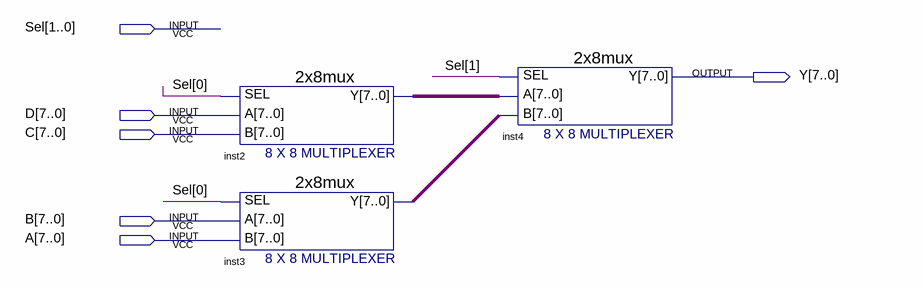
[diagram p0: schematic sheet]
// Quartus schematic mux4x8.bdf as structural Verilog: 3 symbols, 6 pins
module mux4x8 (
  input  [1:0] Sel,
  input  [7:0] D,
  input  [7:0] C,
  input  [7:0] B,
  input  [7:0] A,
  output [7:0] Y
);

  wire [7:0] inst2_y, inst3_y;

  \2x8mux  inst2 (.SEL(Sel[0]), .A(D), .B(C), .Y(inst2_y));
  \2x8mux  inst3 (.SEL(Sel[0]), .A(B), .B(A), .Y(inst3_y));
  \2x8mux  inst4 (.SEL(Sel[1]), .A(inst2_y), .B(inst3_y), .Y(Y));
endmodule
